# EasyEDA schematic SCH_2023-10-16.json
TITLE: Sheet_1; REV: 1.0; Date: 2023-10-14; Sheet: 1/1; Company: Samarpan
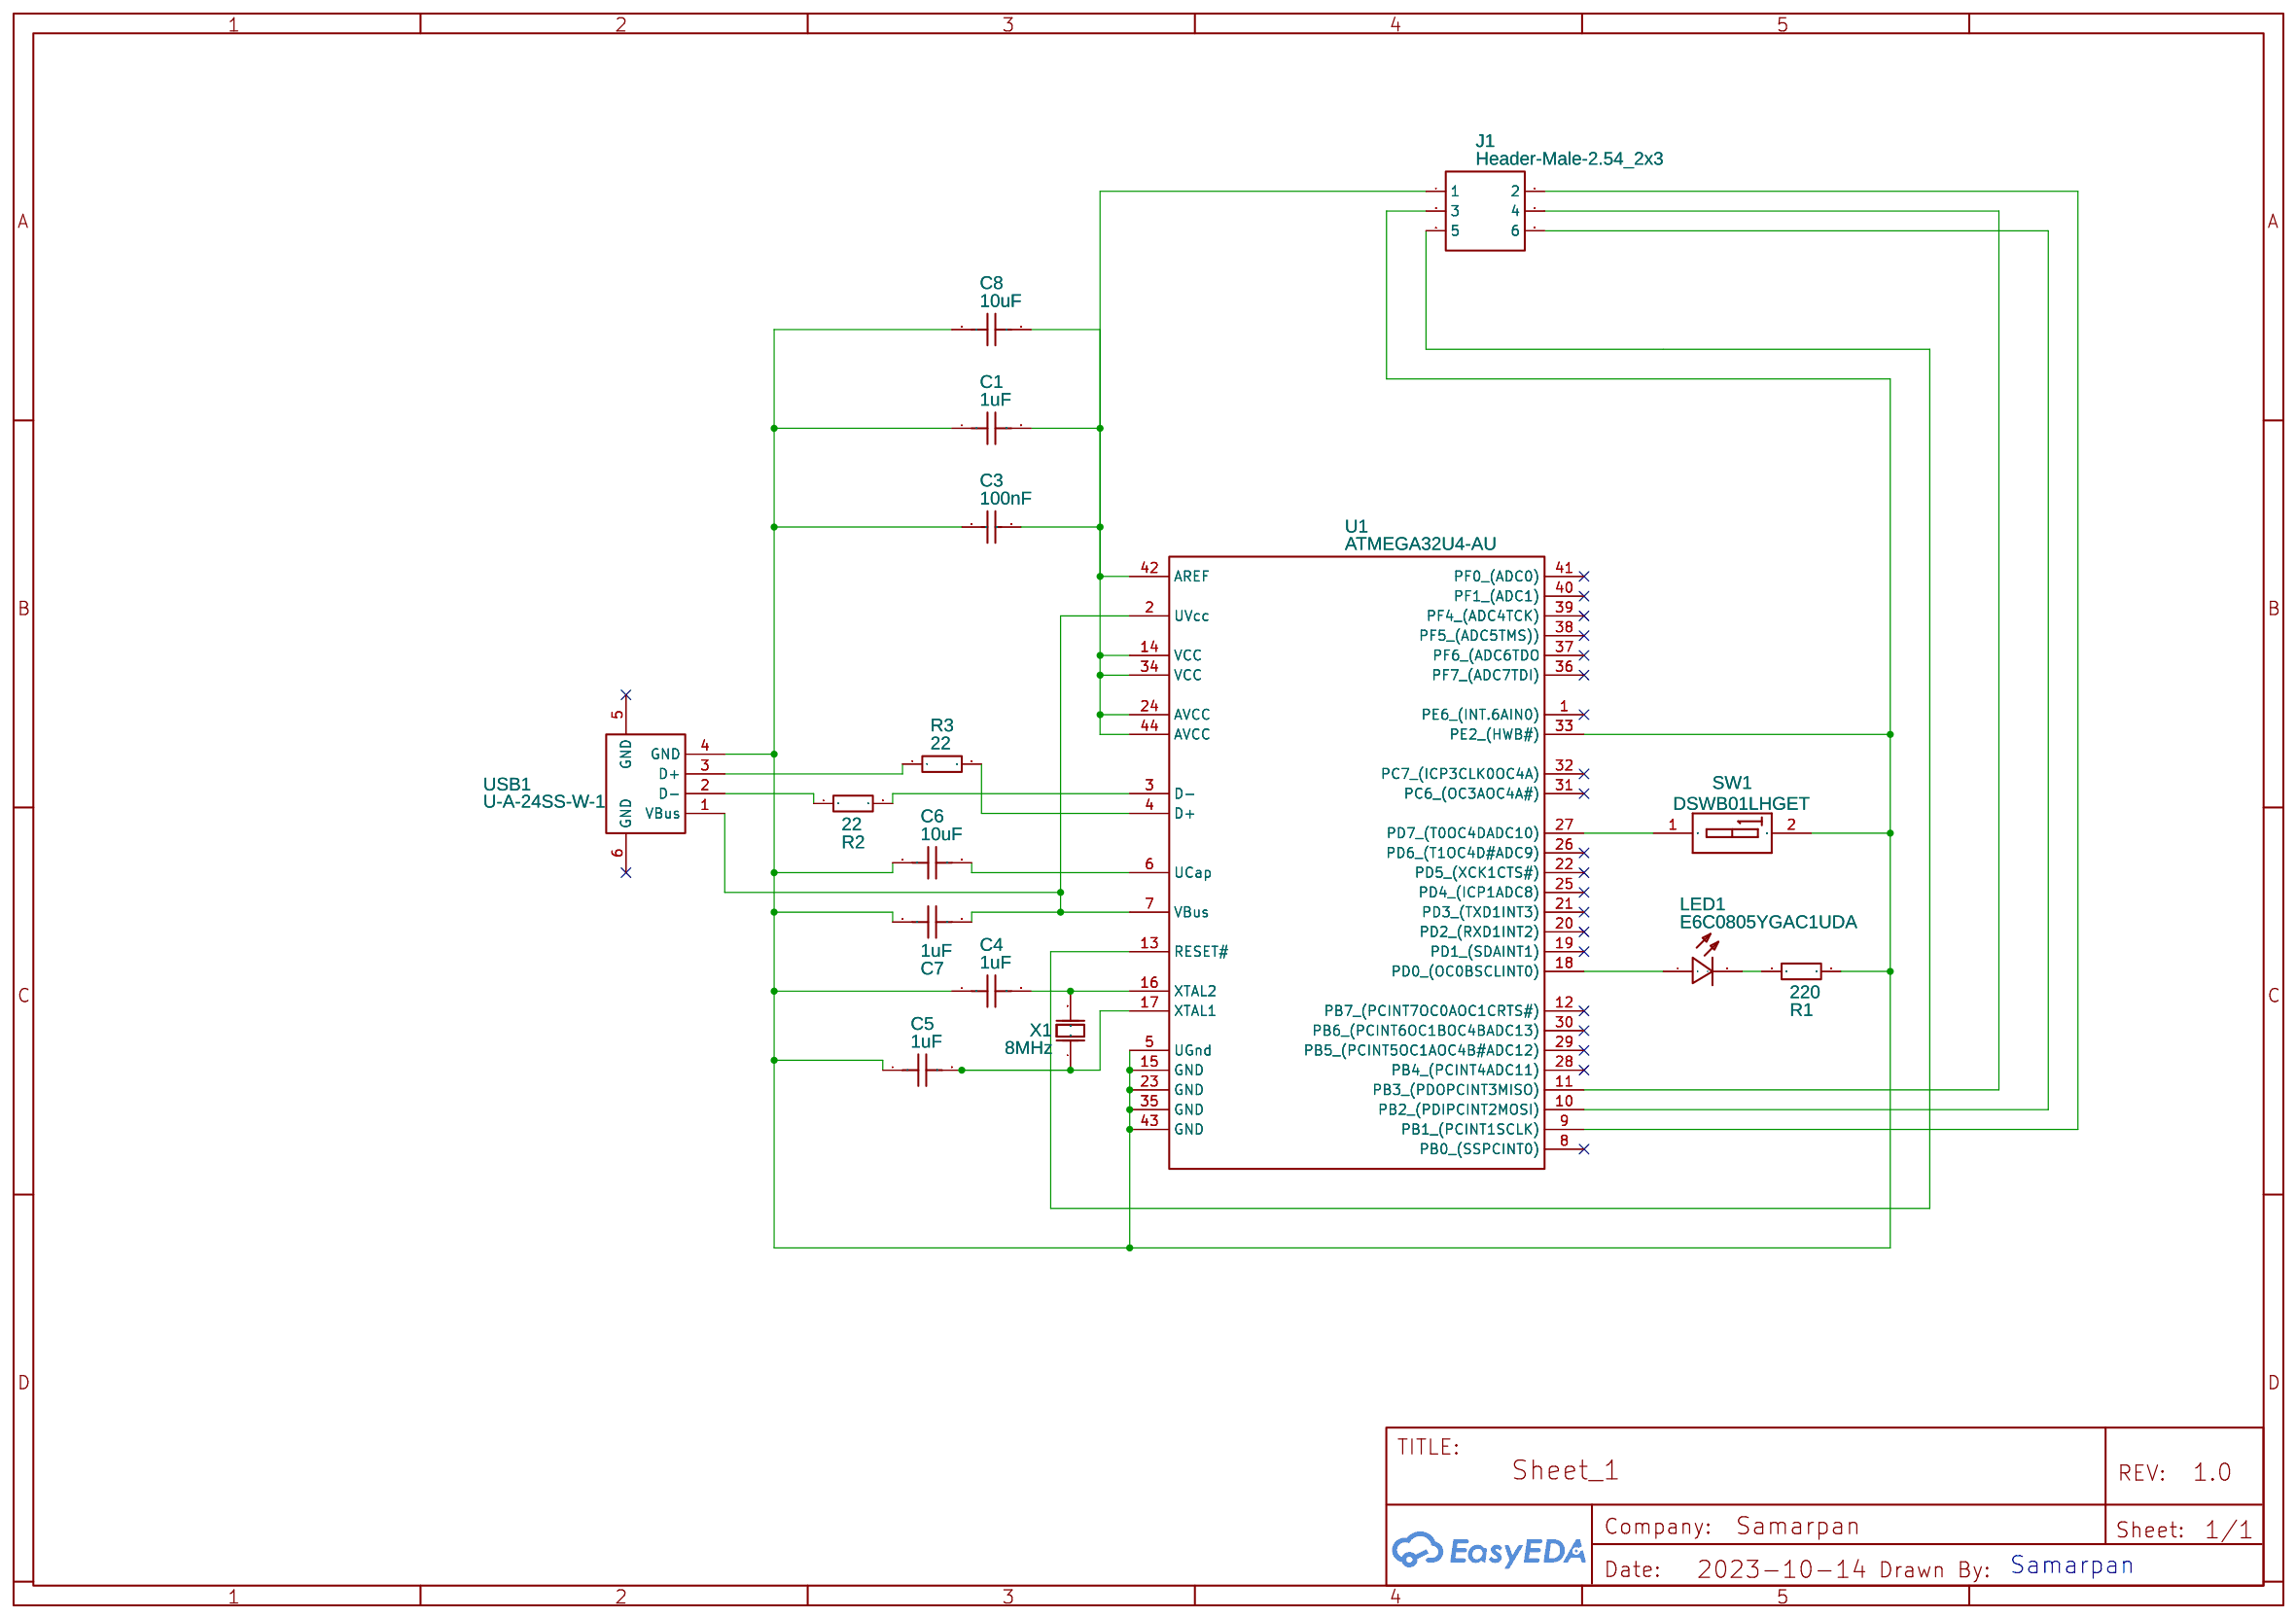
[diagram p0: schematic sheet]

## Parts
C1  1uF  [0402]
C3  100nF  [0402]
C4  1uF  [0402]
C5  1uF  [0402]
C6  10uF  [0603]
C7  1uF  [0402]
C8  10uF  [0603]
J1  Header-Male-2.54_2x3  [HDR-TH_6PIN-V-ROW2-COL3-MALE-PITCH2.54]
LED1  E6C0805YGAC1UDA  [LED-SMD_2PIN-L2.00-W1.25-L-FD]
R1  220  [0805]
R2  22  [0805]
R3  22  [0805]
SW1  DSWB01LHGET  [DSWB01LHGET]
U1  ATMEGA32U4-AU  [QFP-44_L10.0-W10.0-P0.80-LS13.2-BL]
USB1  U-A-24SS-W-1  [USB-A-SMD_U-A-24SS-W-1]
X1  8MHz  [OSC-SMD_2P-L5.0-W3.2]

## Library data of the parts
C1 C4 C5 C7 = CC0402KRX5R6BB105: Supplier: LCSC; Manufacturer: YAGEO; Supplier Part: C106254
C3 = 0402B104K160NT: Supplier: LCSC; Manufacturer: FH; Supplier Part: C41851
C6 C8 = CL10A106KP8NNNC: Supplier: LCSC; Manufacturer: SAMSUNG; LCSC Assembly: Yes; Supplier Part: C19702; SMT Type: Basic
J1 = -: Supplier: LCSC; Manufacturer: BOOMELE; Supplier Part: C65114
LED1 = -: Supplier: LCSC; Supplier Part: C375456; Manufacturer: EKINGLUX; Contributor: LCSC
R1 = ARG05FTC2200: Supplier: LCSC; Supplier Part: C218431; Manufacturer: Viking Tech; Contributor: LCSC
R2 R3 = TC0525F220JT5E: Supplier: LCSC; Manufacturer: UniOhm; Supplier Part: C65068; LCSC Assembly: Yes; SMT Type: Extend
SW1 = -: Supplier: LCSC; Manufacturer: KE; Supplier Part: C126888
U1 = -: Supplier: LCSC; Manufacturer: MICROCHIP; image: //image.lceda.cn/szlcsc/C44854.jpg; Supplier Part: C44854; LCSC Assembly: Yes; SMT Type: Extend
USB1 = -: Supplier: LCSC; Supplier Part: C283549; Manufacturer: Korean Hroparts Elec; Contributor: LCSC
X1 = XSHEELNANF-8MHZ: Supplier: LCSC; Supplier Part: C242219; Manufacturer: TAITIEN Elec; Contributor: LCSC

## Nets
Net-(C1-1): C1.1 C3.1 C4.1 C5.1 C6.1 C7.1 C8.1 J1.3 R1.2 SW1.2 U1.5(UGnd) U1.15(GND) U1.23(GND) U1.33(PE2 (HWB#)) U1.35(GND) U1.43(GND) USB1.4(GND)
Net-(C1-2): C1.2 C3.2 C8.2 J1.1 U1.14(VCC) U1.24(AVCC) U1.34(VCC) U1.42(AREF) U1.44(AVCC)
Net-(C4-2): C4.2 U1.16(XTAL2) X1.2(OSC2)
Net-(C5-2): C5.2 U1.17(XTAL1) X1.1(OSC1)
Net-(C6-2): C6.2 U1.6(UCap)
Net-(C7-2): C7.2 U1.2(UVcc) U1.7(VBus) USB1.1(VBus)
Net-(J1-2): J1.2 U1.9(PB1 (PCINT1SCLK))
Net-(J1-4): J1.4 U1.11(PB3 (PDOPCINT3MISO))
Net-(J1-5): J1.5 U1.13(RESET#)
Net-(J1-6): J1.6 U1.10(PB2 (PDIPCINT2MOSI))
Net-(LED1-1): LED1.1(+) U1.18(PD0 (OC0BSCLINT0))
Net-(LED1-2): LED1.2(-) R1.1
Net-(R2-1): R2.1 USB1.2(D-)
Net-(R2-2): R2.2 U1.3(D-)
Net-(R3-1): R3.1 USB1.3(D+)
Net-(R3-2): R3.2 U1.4(D+)
Net-(SW1-1): SW1.1(A1) U1.27(PD7 (T0OC4DADC10))

Not connected (* = marked no-connect by the designer): U1 1(PE6 (INT.6AIN0))* 8(PB0 (SSPCINT0))* 12(PB7 (PCINT7OC0AOC1CRTS#))* 19(PD1 (SDAINT1))* 20(PD2 (RXD1INT2))* 21(PD3 (TXD1INT3))* 22(PD5 (XCK1CTS#))* 25(PD4 (ICP1ADC8))* 26(PD6 (T1OC4D#ADC9))* 28(PB4 (PCINT4ADC11))* 29(PB5 (PCINT5OC1AOC4B#ADC12))* 30(PB6 (PCINT6OC1BOC4BADC13))* 31(PC6 (OC3AOC4A#))* 32(PC7 (ICP3CLK0OC4A))* 36(PF7 (ADC7TDI))* 37(PF6 (ADC6TDO)* 38(PF5 (ADC5TMS)))* 39(PF4 (ADC4TCK))* 40(PF1 (ADC1))* 41(PF0 (ADC0))*; USB1 5(GND)* 6(GND)*

## Notes on the sheet
- Samarpan
